# Altium project PCB_Project1.PrjPCB
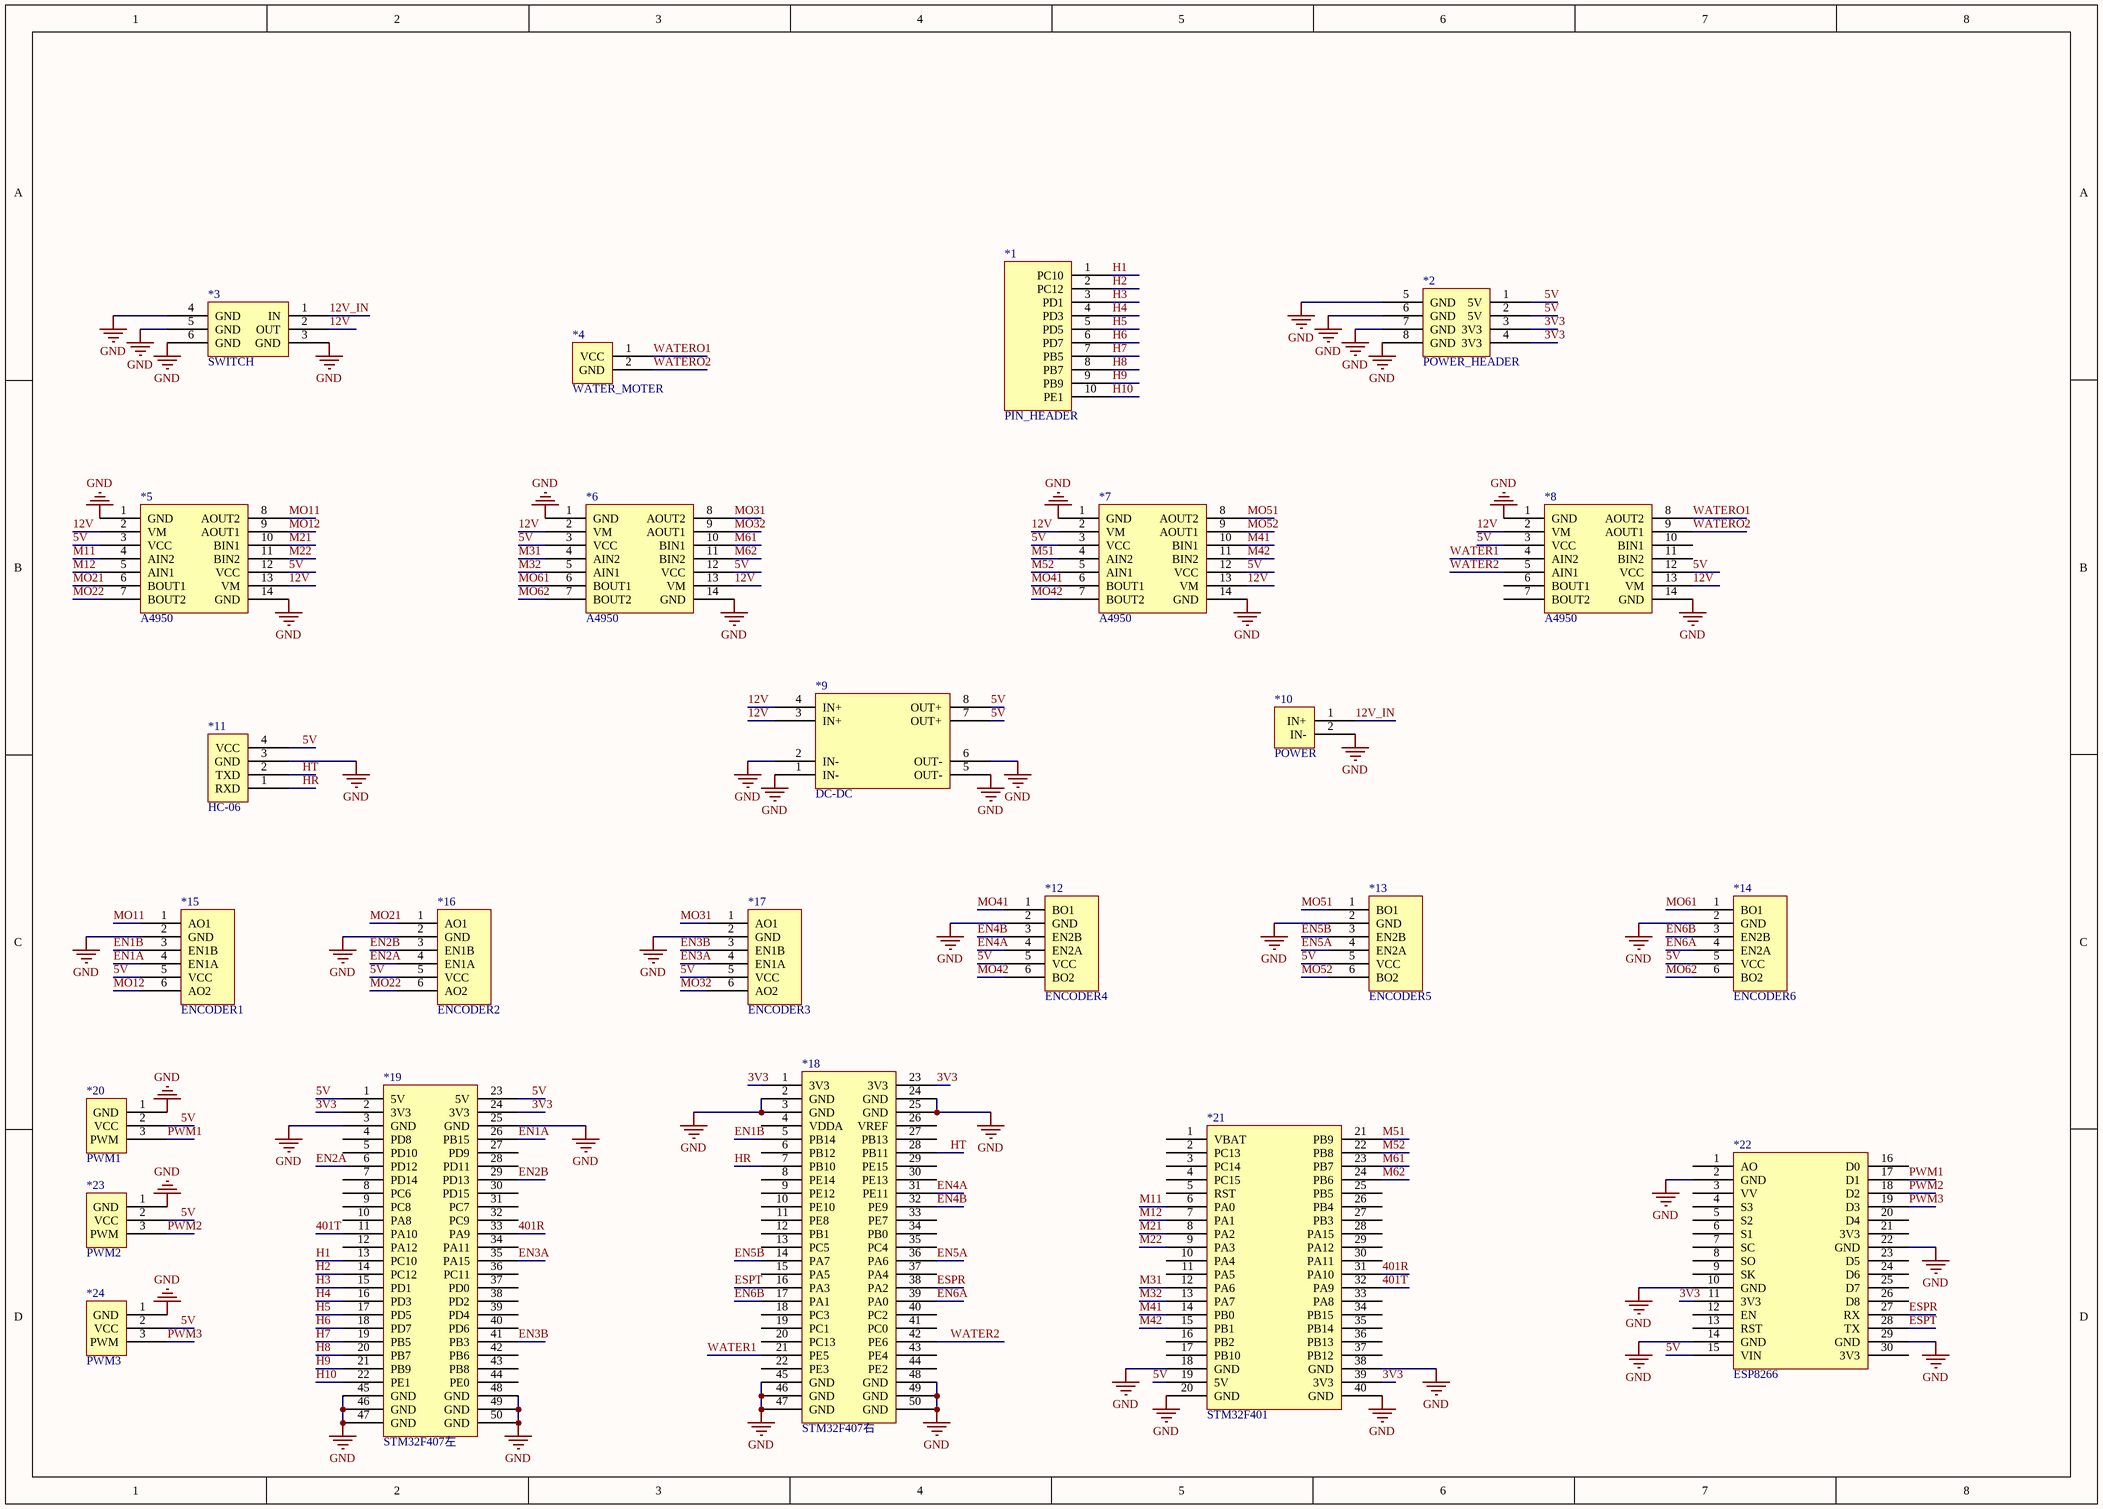
[diagram p0: Sheet1.SchDoc]
1 sheet, 24 parts. Net scope: global (net labels, ports and power ports of the same name join across sheets).
Board file: PCB1.PcbDoc

## Sheet Sheet1.SchDoc
size A3

### Parts
*1  PIN_HEADER  [PIN_HEADER]
*2  POWER_HEADER  [POWER_HEADER]
*3  SWITCH  [SIWITCH]
*4  WATER_MOTER  [WATER_HEADER]
*5  A4950  [A4950]
*6  A4950  [A4950]
*7  A4950  [A4950]
*8  A4950  [A4950]
*9  DC-DC  [DC-DC]
*10  POWER  [POWER]
*11  HC-06  [HC-06]
*12  ENCODER4  [ENCODER2]
*13  ENCODER5  [ENCODER2]
*14  ENCODER6  [ENCODER2]
*15  ENCODER1  [ENCODER1]
*16  ENCODER2  [ENCODER1]
*17  ENCODER3  [ENCODER1]
*18  STM32F407右  [STM32F407左]
*19  STM32F407左  [STM32F407左]
*20  PWM1  [PWM]
*21  STM32F401  [STM32F401CCU6]
*22  ESP8266  [ESP]
*23  PWM2  [PWM]
*24  PWM3  [PWM]

### Nets
GND: *2.5(GND) *2.6(GND) *2.7(GND) *2.8(GND) *3.3(GND) *3.4(GND) *3.5(GND) *3.6(GND) *5.1(GND) *5.14(GND) *6.1(GND) *6.14(GND) *7.1(GND) *7.14(GND) *8.1(GND) *8.14(GND) *9.1(IN-) *9.2(IN-) *9.5(OUT-) *9.6(OUT-) *10.2(IN-) *11.3(GND) *12.2(GND) *13.2(GND) *14.2(GND) *15.2(GND) *16.2(GND) *17.2(GND) *18.2(GND) *18.3(GND) *18.24(GND) *18.25(GND) *18.45(GND) *18.46(GND) *18.47(GND) *18.48(GND) *18.49(GND) *18.50(GND) *19.3(GND) *19.25(GND) *19.45(GND) *19.46(GND) *19.47(GND) *19.48(GND) *19.49(GND) *19.50(GND) *20.1(GND) *21.18(GND) *21.20(GND) *21.38(GND) *21.40(GND) *22.2(GND) *22.10(GND) *22.14(GND) *22.22(GND) *22.29(GND) *23.1(GND) *24.1(GND)
3V3: *2.3(3V3) *2.4(3V3) *18.1(3V3) *18.23(3V3) *19.2(3V3) *19.24(3V3) *21.39(3V3) *22.11(3V3)
5V: *2.1(5V) *2.2(5V) *5.3(VCC) *5.12(VCC) *6.3(VCC) *6.12(VCC) *7.3(VCC) *7.12(VCC) *8.3(VCC) *8.12(VCC) *9.7(OUT+) *9.8(OUT+) *11.4(VCC) *12.5(VCC) *13.5(VCC) *14.5(VCC) *15.5(VCC) *16.5(VCC) *17.5(VCC) *19.1(5V) *19.23(5V) *20.2(VCC) *21.19(5V) *22.15(VIN) *23.2(VCC) *24.2(VCC)
12V: *3.2(OUT) *5.2(VM) *5.13(VM) *6.2(VM) *6.13(VM) *7.2(VM) *7.13(VM) *8.2(VM) *8.13(VM) *9.3(IN+) *9.4(IN+)
12V_IN: *3.1(IN) *10.1(IN+)
401R: *19.33(PA9) *21.31(PA10)
401T: *19.11(PA10) *21.32(PA9)
EN1A: *15.4(EN1A) *19.26(PB15)
EN1B: *15.3(EN1B) *18.5(PB14)
EN2A: *16.4(EN1A) *19.6(PD12)
EN2B: *16.3(EN1B) *19.29(PD13)
EN3A: *17.4(EN1A) *19.35(PA15)
EN3B: *17.3(EN1B) *19.41(PB3)
EN4A: *12.4(EN2A) *18.31(PE11)
EN4B: *12.3(EN2B) *18.32(PE9)
EN5A: *13.4(EN2A) *18.36(PA6)
EN5B: *13.3(EN2B) *18.14(PA7)
EN6A: *14.4(EN2A) *18.39(PA0)
EN6B: *14.3(EN2B) *18.17(PA1)
ESPR: *18.38(PA2) *22.27(RX)
ESPT: *18.16(PA3) *22.28(TX)
H1: *1.1(PC10) *19.13(PC10)
H2: *1.2(PC12) *19.14(PC12)
H3: *1.3(PD1) *19.15(PD1)
H4: *1.4(PD3) *19.16(PD3)
H5: *1.5(PD5) *19.17(PD5)
H6: *1.6(PD7) *19.18(PD7)
H7: *1.7(PB5) *19.19(PB5)
H8: *1.8(PB7) *19.20(PB7)
H9: *1.9(PB9) *19.21(PB9)
H10: *1.10(PE1) *19.22(PE1)
HR: *11.1(RXD) *18.7(PB10)
HT: *11.2(TXD) *18.28(PB11)
M11: *5.4(AIN2) *21.6(PA0)
M12: *5.5(AIN1) *21.7(PA1)
M21: *5.10(BIN1) *21.8(PA2)
M22: *5.11(BIN2) *21.9(PA3)
M31: *6.4(AIN2) *21.12(PA6)
M32: *6.5(AIN1) *21.13(PA7)
M41: *7.10(BIN1) *21.14(PB0)
M42: *7.11(BIN2) *21.15(PB1)
M51: *7.4(AIN2) *21.21(PB9)
M52: *7.5(AIN1) *21.22(PB8)
M61: *6.10(BIN1) *21.23(PB7)
M62: *6.11(BIN2) *21.24(PB6)
MO11: *5.8(AOUT2) *15.1(AO1)
MO12: *5.9(AOUT1) *15.6(AO2)
MO21: *5.6(BOUT1) *16.1(AO1)
MO22: *5.7(BOUT2) *16.6(AO2)
MO31: *6.8(AOUT2) *17.1(AO1)
MO32: *6.9(AOUT1) *17.6(AO2)
MO41: *7.6(BOUT1) *12.1(BO1)
MO42: *7.7(BOUT2) *12.6(BO2)
MO51: *7.8(AOUT2) *13.1(BO1)
MO52: *7.9(AOUT1) *13.6(BO2)
MO61: *6.6(BOUT1) *14.1(BO1)
MO62: *6.7(BOUT2) *14.6(BO2)
PWM1: *20.3(PWM) *22.17(D1)
PWM2: *22.18(D2) *23.3(PWM)
PWM3: *22.19(D3) *24.3(PWM)
WATER1: *8.4(AIN2) *18.21(PE5)
WATER2: *8.5(AIN1) *18.42(PE6)
WATERO1: *4.1(VCC) *8.8(AOUT2)
WATERO2: *4.2(GND) *8.9(AOUT1)

Not connected (* = marked no-connect by the designer): *8 6(BOUT1) 7(BOUT2) 10(BIN1) 11(BIN2); *18 4(VDDA) 6(PB12) 8(PE14) 9(PE12) 10(PE10) 11(PE8) 12(PB1) 13(PC5) 15(PA5) 18(PC3) 19(PC1) 20(PC13) 22(PE3) 26(VREF) 27(PB13) 29(PE15) 30(PE13) 33(PE7) 34(PB0) 35(PC4) 37(PA4) 40(PC2) 41(PC0) 43(PE4) 44(PE2); *19 4(PD8) 5(PD10) 7(PD14) 8(PC6) 9(PC8) 10(PA8) 12(PA12) 27(PD9) 28(PD11) 30(PD15) 31(PC7) 32(PC9) 34(PA11) 36(PC11) 37(PD0) 38(PD2) 39(PD4) 40(PD6) 42(PB6) 43(PB8) 44(PE0); *21 1(VBAT) 2(PC13) 3(PC14) 4(PC15) 5(RST) 10(PA4) 11(PA5) 16(PB2) 17(PB10) 25(PB5) 26(PB4) 27(PB3) 28(PA15) 29(PA12) 30(PA11) 33(PA8) 34(PB15) 35(PB14) 36(PB13) 37(PB12); *22 1(AO) 3(VV) 4(S3) 5(S2) 6(S1) 7(SC) 8(SO) 9(SK) 12(EN) 13(RST) 16(D0) 20(D4) 21(3V3) 23(D5) 24(D6) 25(D7) 26(D8) 30(3V3)